# Altium project T1_Card.PrjPcb (part 2 of 6)

## Sheet LM76003.SchDoc
size 431 x 279 mm; Date: Not shown in title block; ApprovedBy: Not shown in title block; CheckedBy: Not shown in title block; Author: Not shown in title block; CompanyName: Not shown in title block; DrawnBy: Andy Lin (TI); Engineer: Not shown in title block; Organization: Not shown in title block; Address1: Not shown in title block; Address2: Not shown in title block; Address3: Not shown in title block; Address4: Not shown in title block; DocumentNumber: 6; Revision: Use project parameter SCH_Rev; SheetNumber: 6; SheetTotal: 14; PageSetup: Record=PageOptions|CenterHorizontal=True|CenterVertical=True|PrintScale=1.00|XCorrection=1.00|YCorrection=1.00|PrintKind=0|BorderSize=5000000|LeftOffset=0|BottomOffset=0|Orientation=2|PaperLength=1000|PaperWidth=1000|Scale=100|PaperSource=15|PrintQuality=600|MediaType=1|DitherType=10|PaperKind=Letter|PrintScaleMode=1; CurrentTime: Not shown in title block; CurrentDate: Not shown in title block; Time: Not shown in title block; DocumentFullPathAndName: Not shown in title block; DocumentName: Not shown in title block; ModifiedDate: Not shown in title block; ImagePath: Not shown in title block
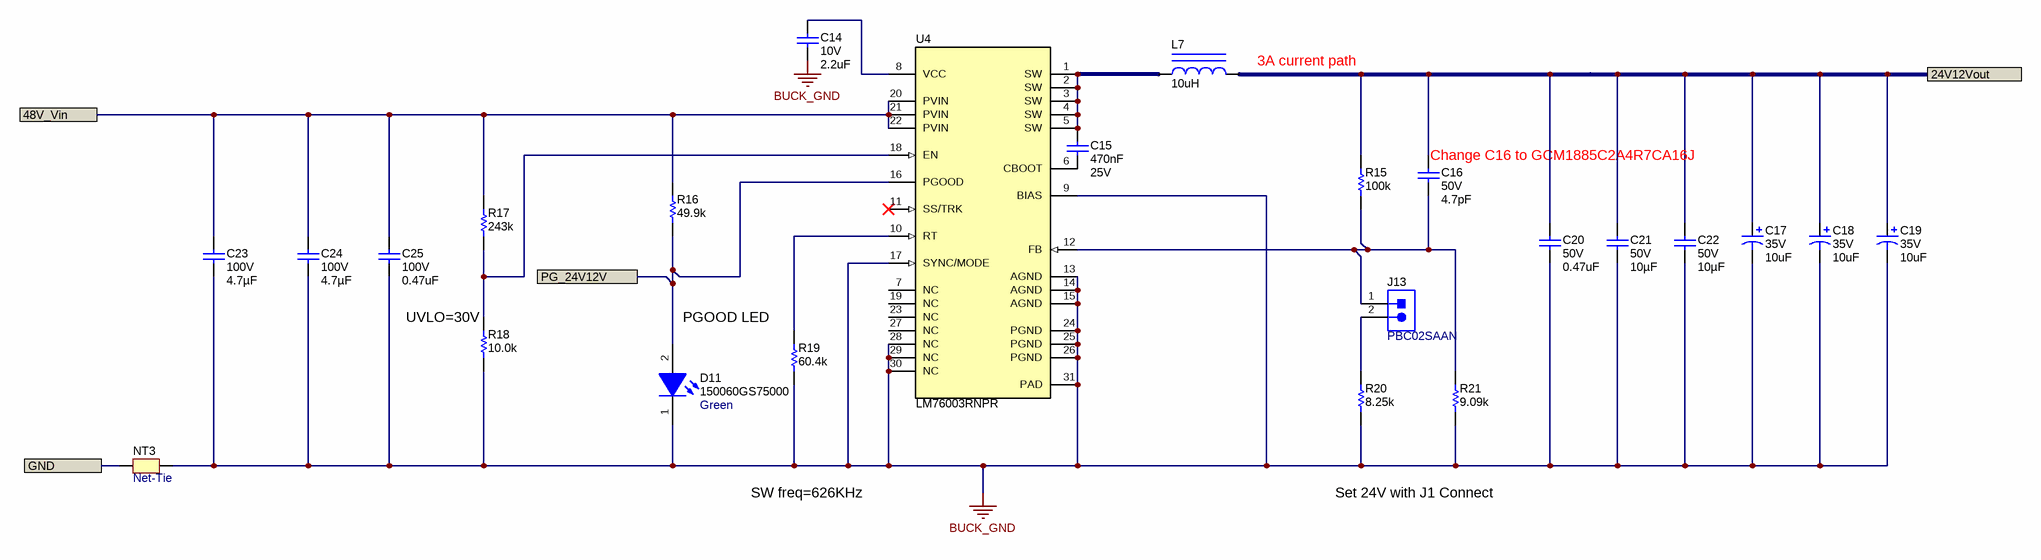
[diagram p3: LM76003.SchDoc]

### Parts
C14  VDC_V: 10V  ValueDisplayed: 2.2uF  [0603]  (hidden comment: GRM188R71A225KE15D)
C15  Cap_F: 470nF  VDC_V: 25V  [0603]  (hidden comment: GCM188R71E474KA64D)
C16  VDC_V: 50V  ValueDisplayed: 4.7pF  [0603]  (hidden comment: 06035A4R7CAT2A)
C17  VDC_V: 35V  ValueDisplayed: 10uF  [7343-31]  (hidden comment: 593D106X9035D2TE3)
C18  VDC_V: 35V  ValueDisplayed: 10uF  [7343-31]  (hidden comment: 593D106X9035D2TE3)
C19  VDC_V: 35V  ValueDisplayed: 10uF  [7343-31]  (hidden comment: 593D106X9035D2TE3)
C20  VDC_V: 50V  ValueDisplayed: 0.47uF  [0805_HV]  (hidden comment: GRM21BR71H474KA88L)
C21  VDC_V: 50V  ValueDisplayed: 10µF  [1210_280]  (hidden comment: GRJ32ER71H106KE11L)
C22  VDC_V: 50V  ValueDisplayed: 10µF  [1210_280]  (hidden comment: GRJ32ER71H106KE11L)
C23  VDC_V: 100V  ValueDisplayed: 4.7µF  [1210_220]  (hidden comment: GCM32DC72A475KE02L)
C24  VDC_V: 100V  ValueDisplayed: 4.7µF  [1210_220]  (hidden comment: GCM32DC72A475KE02L)
C25  VDC_V: 100V  ValueDisplayed: 0.47uF  [0805_HV]  (hidden comment: GRM21BR72A474KA73L)
D11  150060GS75000  value Green  [WL-SMCW_GREEN]
J13  PBC02SAAN  [Sullins_PBC02SAAN]
L7  ValueDisplayed: 10uH  [WE-LHMI_7030]  (hidden comment: 74437346100)
NT3  Net-Tie  [Net-Tie_50milWide_30milLong]  (net tie, no BOM)
R15  ValueDisplayed: 100k  [0402]  (hidden comment: CRCW0402100KFKED)
R16  ValueDisplayed: 49.9k  [0603]  (hidden comment: CRCW060349K9FKEA)
R17  ValueDisplayed: 243k  [0402]  (hidden comment: CRCW0402243KFKED)
R18  ValueDisplayed: 10.0k  [0402]  (hidden comment: CRCW040210K0FKED)
R19  ValueDisplayed: 60.4k  [0402]  (hidden comment: CRCW040260K4FKED)
R20  ValueDisplayed: 8.25k  [0402]  (hidden comment: CRCW04028K25FKED)
R21  ValueDisplayed: 9.09k  [0402]  (hidden comment: CRCW04029K09FKED)
U4  LM76003RNPR  [RNP0030B]

### Ports
24V12Vout, 48V_Vin, GND, PG_24V12V

### Nets
BUCK_GND: C14.2 C17.2(-) C18.2(-) C19.2(-) C20.2 C21.2 C22.2 C23.2 C24.2 C25.2 D11.1(K) NT3.2 R18.1 R19.1 R20.1 R21.1 U4.9(BIAS) U4.13(AGND) U4.14(AGND) U4.15(AGND) U4.17(SYNC/MODE) U4.24(PGND) U4.25(PGND) U4.26(PGND) U4.28(NC) U4.29(NC) U4.30(NC) U4.31(PAD)
ILIM_GND: NT3.1 ; port GND
24V12Vout: C16.1 C17.1(+) C18.1(+) C19.1(+) C20.1 C21.1 C22.1 L7.2 R15.2 ; port 24V12Vout
48V_Vin: C23.1 C24.1 C25.1 R16.2 R17.2 U4.20(PVIN) U4.21(PVIN) U4.22(PVIN) ; port 48V_Vin
PG_24V12V: D11.2(A) R16.1 U4.16(PGOOD) ; port PG_24V12V
NetC14_1: C14.1 U4.8(VCC)
NetC15_1: C15.1 L7.1 U4.1(SW) U4.2(SW) U4.3(SW) U4.4(SW) U4.5(SW)
NetC15_2: C15.2 U4.6(CBOOT)
NetC16_2: C16.2 J13.1 R15.1 R21.2 U4.12(FB)
NetJ13_2: J13.2 R20.2
NetR17_1: R17.1 R18.2 U4.18(EN)
NetR19_2: R19.2 U4.10(RT)

Not connected (* = marked no-connect by the designer): U4 7(NC) 11(SS/TRK)* 19(NC) 23(NC) 27(NC)

### Notes on the sheet
- (near L7) 3A current path
- (near C16) Change C16 to GCM1885C2A4R7CA16J
- (near R18) UVLO=30V
- PGOOD LED
- SW freq=626KHz
- Set 24V with J1 Connect
- Drawn By:
- SVN Rev:
- Number:
- TID #:
- Orderable:
- Rev:
- Sheet Title:
- File:
- Project Title:
- Designed for:
- Assembly Variant:
- Mod. Date:
- Sheet:
- Size:
- of
- B
- http://www.ti.com
- Texas Instruments and/or its licensors do not warrant the accuracy or completeness of this specification or any information contained therein. Texas Instruments and/or its licensors do not warrant that this design will meet the specifications, will be suitable for your application or fit for any particular purpose, or will operate in an implementation. Texas Instruments and/or its licensors do not warrant that the design is production worthy. You should completely validate and test your design implementation to confirm the system functionality for your application.
- Engineer:
- Contact:
- © Texas Instruments

### Library data of the parts
C14 = CMP-0007370-4: CAP, CERM, 2.2 uF, 10 V, +/- 10%, X7R, 0603; Manufacturer: MuRata; TaMin_C: -55°C; ESR_ohm: 9m; Polarized: N; SizeAreaWB_mm2: 4.68; Value1: 0.009 ohm; U/M: EA; Value: 2.2uF; TaMax_C: 125°C; SizeZ_mm: 1; SizeX_mm: 1.6; SizeY_mm: 0.8; SizeArea_mm2: 1.28; Cap_F: 2.2µF; AEC Category: Q200; Supplier Part Number 2: 81-GRM188R71A225KE15; Publisher: Texas Instruments; Supplier 2: Mouser; Supplier Part Number 3: 1797012; TempCo: X7R; Supplier 3: Farnell; Published: 2008-06-19; RoHS: Y; MountType: SMT; Supplier 1: Digi-Key; PackageReference: 0603; Tolerance_%: 10%; Cap_Case: 0603; Value2: 10V; CompType: Capacitor; LatestRevisionDate: 2017-03-09; PartNumber: GRM188R71A225KE15D; AEC Qualified: ?; ComponentLink1Description: Datasheet link; Supplier Part Number 1: 490-4520-1-ND; Technology: Ceramic; ComponentLink1URL: http://search.murata.co.jp/Ceramy/PnsearchViewAction.do?HnOFG=ON&HnNFG=ON&SEL_CNT=50&sLang=en&sKey=GRM188R71A225KE15D&x=9&y=9&search=startwith
C15 = CMP-0007142-4: CAP, CERM, 0.47 uF, 25 V, +/- 10%, X7R, AEC-Q200 Grade 1, 0603; Manufacturer: MuRata; TaMin_C: -55°C; Polarized: N; SizeAreaWB_mm2: 4.68; Value1: Unknown; U/M: EA; Value: 0.47uF; TaMax_C: 125°C; SizeZ_mm: 1; SizeX_mm: 1.6; SizeY_mm: 0.8; SizeArea_mm2: 1.28; AEC Qualified: Y; AEC Category: Q200; Supplier Part Number 2: 81-GCM188R71E474KA4D; Publisher: Texas Instruments; Supplier 2: Mouser; TempCo: X7R; Published: 2008-06-19; RoHS: Y; MountType: SMT; Supplier 1: Digi-Key; PackageReference: 0603; Tolerance_%: 10%; Cap_Case: 0603; Value2: 25V; CompType: Capacitor; LatestRevisionDate: 2017-03-09; PartNumber: GCM188R71E474KA64D; ComponentLink1Description: Datasheet link; AEC Grade: 1; Supplier Part Number 1: 490-4776-1-ND; Technology: Ceramic; ValueDisplayed: 0.47uF; ComponentLink1URL: http://psearch.murata.com/capacitor/product/GCM188R71E474KA64%23.pdf
C16 = CMP-0006791-4: CAP, CERM, 4.7 pF, 50 V, +/- 5%, C0G/NP0, 0603; Manufacturer: AVX; TaMin_C: -55°C; ESR_ohm: 0.633; Polarized: N; SizeAreaWB_mm2: 4.68; Value1: 0.633 ohm; U/M: EA; Value: 4.7pF; TaMax_C: 125°C; SizeZ_mm: 1; SizeX_mm: 1.6; SizeY_mm: 0.8; SizeArea_mm2: 1.28; AEC Category: Q200; Supplier Part Number 2: 581-06035A4R7C; Publisher: Texas Instruments; Supplier 2: Mouser; Supplier Part Number 3: 1833866; TempCo: C0G/NP0; Supplier 3: Farnell; Published: 2008-06-19; RoHS: Y; MountType: SMT; Supplier 1: Digi-Key; PackageReference: 0603; Tolerance_%: 5%; Cap_Case: 0603; Value2: 50V; CompType: Capacitor; LatestRevisionDate: 2017-03-09; PartNumber: 06035A4R7CAT2A; AEC Qualified: N; Cap_F: 4.7pF; ComponentLink1Description: Datasheet link; AEC Grade: N/A; Supplier Part Number 1: 478-1159-1-ND; Technology: Ceramic; ComponentLink1URL: http://datasheets.avx.com/C0GNP0-Dielectric.pdf
C17 = CMP-0011718-2: CAP, TA, 10 uF, 35 V, +/- 10%, 0.3 ohm, SMD; Manufacturer: Vishay-Sprague; TaMin_C: -55°C; ESR_ohm: 0.3; Polarized: Y; SizeAreaWB_mm2: 58.59; Value1: 0.3 ohm; U/M: EA; Value: 10uF; TaMax_C: 125°C; SizeZ_mm: 3.1; SizeX_mm: 7.3; SizeY_mm: 4.3; Cap_Case: D; SizeArea_mm2: 31.39; CompType: Capacitor; Cap_F: 10µF; IRMS_A: 710mA; AEC Category: Q200; ComponentLink1URL: http://www.vishay.com/docs/40005/593d.pdf; Supplier Part Number 2: 65K2991; Publisher: Texas Instruments; Supplier 2: Newark; Supplier Part Number 3: 74-593D106X9035D2TE3; Supplier 3: Mouser; RoHS: Y; MountType: SMT; Supplier 1: Digi-Key; LatestRevisionNote: Updated supplier links; PackageReference: 7343-31; Tolerance_%: 10%; Value2: 35V; LatestRevisionDate: 2017-03-09; PartNumber: 593D106X9035D2TE3; AEC Qualified: ?; Series: 593D; ComponentLink1Description: Datasheet link; Supplier Part Number 1: 718-1099-1-ND; Technology: TA
C18 C19 = CMP-0011718-1: CAP, TA, 10 uF, 35 V, +/- 10%, 0.3 ohm, SMD; Manufacturer: Vishay-Sprague; TaMin_C: -55°C; ESR_ohm: 0.3; Polarized: Y; SizeAreaWB_mm2: 58.59; Value1: 0.3 ohm; U/M: EA; Value: 10uF; TaMax_C: 125°C; SizeZ_mm: 3.1; SizeX_mm: 7.3; SizeY_mm: 4.3; Cap_Case: D; SizeArea_mm2: 31.39; CompType: Capacitor; Cap_F: 10µF; IRMS_A: 710mA; AEC Category: Q200; ComponentLink1URL: http://www.vishay.com/docs/40005/593d.pdf; Supplier Part Number 2: 65K2991; Publisher: Texas Instruments; Supplier 2: Newark; Supplier Part Number 3: 74-593D106X9035D2TE3; Supplier 3: Mouser; RoHS: Y; MountType: SMT; Supplier 1: Digi-Key; LatestRevisionNote: Updated supplier links; PackageReference: 7343-31; Tolerance_%: 10%; Value2: 35V; LatestRevisionDate: 2017-03-09; PartNumber: 593D106X9035D2TE3; AEC Qualified: ?; Series: 593D; ComponentLink1Description: Datasheet link; Supplier Part Number 1: 718-1099-1-ND; Technology: TA
C20 = CMP-0008357-1: CAP, CERM, 0.47 uF, 50 V, +/- 10%, X7R, 0805; Manufacturer: MuRata; TaMin_C: -55°C; Polarized: N; SizeAreaWB_mm2: 6.75; Value1: Unknown; U/M: EA; Value: 0.47uF; TaMax_C: 125°C; SizeZ_mm: 1.45; SizeX_mm: 2; SizeY_mm: 1.25; Cap_Case: 0805; SizeArea_mm2: 2.5; Cap_F: 470nF; AEC Category: Q200; ComponentLink1URL: http://search.murata.co.jp/Ceramy/PnsearchViewAction.do?HnOFG=ON&HnNFG=ON&SEL_CNT=50&sLang=en&sKey=GRM21BR71H474KA88L&x=9&y=9&search=startwith; Supplier Part Number 2: 81-GRM21BR71H474KA88; Publisher: Texas Instruments; Supplier 2: Mouser; Supplier Part Number 3: 1403966; TempCo: X7R; Supplier 3: Farnell; Published: 2008-06-19; RoHS: Y; MountType: SMT; Supplier 1: Digi-Key; PackageReference: 0805; Tolerance_%: 10%; Value2: 50V; CompType: Capacitor; LatestRevisionDate: 2017-03-09; PartNumber: GRM21BR71H474KA88L; AEC Qualified: ?; ComponentLink1Description: Datasheet link; Supplier Part Number 1: 490-3328-1-ND; Technology: Ceramic
C21 C22 = CMP-0081135-1: CAP, CERM, 10 µF, 50 V,+/- 10%, X7R, 1210; Manufacturer: MuRata; TaMin_C: -55°C; ESR_ohm: 1m; Polarized: N; SizeAreaWB_mm2: 14.7; Value1: 0.001 ohm; U/M: EA; Value: 10uF; TaMax_C: 125°C; SizeZ_mm: 2.8; SizeX_mm: 3.2; SizeY_mm: 2.5; Cap_Case: 1210; SizeArea_mm2: 8; AEC Category: Q200; ComponentLink1URL: https://search.murata.co.jp/Ceramy/image/img/A01X/G101/ENG/GRJ32ER71H106KE11-01.pdf; Supplier Part Number 2: 81-GRJ32ER71H106KE1L; Supplier 2: Mouser; TempCo: X7R; RoHS: Y; MountType: SMT; Supplier 1: Digi-Key; PackageReference: 1210; Tolerance_%: 10%; Value2: 50V; CompType: Capacitor; PartNumber: GRJ32ER71H106KE11L; AEC Qualified: N; Cap_F: 10µF; ComponentLink1Description: Datasheet link; AEC Grade: N/A; Supplier Part Number 1: 490-10961-1-ND; Technology: Ceramic
C23 C24 = CMP-0082268-1: CAP, CERM, 4.7 µF, 100 V,+/- 10%, X7S, AEC-Q200 Grade 1, 1210; Manufacturer: MuRata; TaMin_C: -55°C; ESR_ohm: 1m; Polarized: N; SizeAreaWB_mm2: 14.7; Value1: 0.001 ohm; U/M: EA; Value: 4.7uF; TaMax_C: 125°C; SizeZ_mm: 2.2; SizeX_mm: 3.2; SizeY_mm: 2.5; Cap_Case: 1210; SizeArea_mm2: 8; AEC Qualified: Y; IRMS_A: 6A; AEC Grade: 1; AEC Category: Q200; ComponentLink1URL: https://search.murata.co.jp/Ceramy/image/img/A01X/G101/ENG/GCM32DC72A475KE02-01.pdf; Supplier Part Number 2: 81-GCM32DC72A475KE2L; Supplier 2: Mouser; TempCo: X7S; RoHS: Y; MountType: SMT; Supplier 1: Digi-Key; PackageReference: 1210; Tolerance_%: 10%; Value2: 100V; CompType: Capacitor; PartNumber: GCM32DC72A475KE02L; Cap_F: 4.7µF; ComponentLink1Description: Datasheet link; Supplier Part Number 1: 490-14484-1-ND; Technology: Ceramic
C25 = CMP-0008374-2: CAP, CERM, 0.47 uF, 100 V, +/- 10%, X7R, 0805; Manufacturer: MuRata; TaMin_C: -55°C; Polarized: N; SizeAreaWB_mm2: 6.75; Value1: Unknown; U/M: EA; Value: 0.47uF; TaMax_C: 125°C; SizeZ_mm: 1.45; SizeX_mm: 2; SizeY_mm: 1.25; Cap_Case: 0805; SizeArea_mm2: 2.5; Cap_F: 470nF; AEC Category: Q200; Supplier Part Number 2: 81-GRM21BR72A474KA73; Publisher: Texas Instruments; Supplier 2: Mouser; TempCo: X7R; Published: 2008-06-19; RoHS: Y; MountType: SMT; Supplier 1: Digi-Key; PackageReference: 0805; Tolerance_%: 10%; Value2: 100V; CompType: Capacitor; LatestRevisionDate: 2017-03-09; PartNumber: GRM21BR72A474KA73L; AEC Qualified: ?; ComponentLink1Description: Datasheet link; Supplier Part Number 1: 490-3326-1-ND; Technology: Ceramic; ComponentLink1URL: http://search.murata.co.jp/Ceramy/PnsearchViewAction.do?HnOFG=ON&HnNFG=ON&SEL_CNT=50&sLang=en&sKey=GRM21BR72A474KA73L&x=9&y=9&search=startwith
D11 = CMP-0002905-2: LED, Green, SMD; Manufacturer: Wurth Elektronik; Value1: W; Type: InGaN; Value2: 3.2V; Io_A: 20mA; Angle: 140; Tjmax_C: 85°C; Color: Green; Vf_V: 3.2V; PartNumber: 150060GS75000; ComponentLink1Description: Datasheet link; ComponentLink1URL: http://katalog.we-online.de/led/datasheet/150060GS75000.pdf; MountType: SMT; PackageReference: LED_0603; CompType: LED; RoHS: Y
J13 = CMP-0054566-1: Header, 100mil, 2x1, Gold, TH; Manufacturer: Sullins Connector Solutions; CNHeader: TRUE; Current_A: 3A; Green_Lifecycle: Active; Shrouded: N; Gender: Male; Green_REACh: Passed; Voltage_V: 1.8kV; Row_Count: 1; Pitch_mm: 2.54; CT: FALSE; Cert_UL: Y; ComponentLink1URL: http://www.sullinscorp.com/catalogs/77_PAGE108-109_.100_MALE_HDR.pdf; ClassName: Header; Publisher: Texas Instruments; Color: Black; RoHS: Y; MountType: TH; Green_EU RoHS-2: Passed; Supplier 1: Digi-Key; Green_EU RoHS: Passed; PackageReference: Sullins 100mil, 1x2, 230 mil above insulator; PinCount: 2; CompType: Header; LatestRevisionDate: 26/05/2017; PartNumber: PBC02SAAN; Orientation: Vertical; ComponentLink1Description: Datasheet URL; Supplier Part Number 1: S1011E-02-ND; ContactFinish: Gold
L7 = CMP-0064098-1: Inductor, Shielded Drum Core, Powdered Iron, 10 uH, 3 A, 0.075 ohm, SMD; Manufacturer: Wurth Elektronik; Isat: 7.3A @ 20% inductance drop; Irms: 3A @ 40C rise; Green_Lifecycle: Active; SizeAreaWB_mm2: 73.96; DCR_ohm: 0.075; Green_REACh: Passed; Value: 10uH; Imax_A: 3A; SizeZ_mm: 3; SizeX_mm: 6.6; SizeArea_mm2: 43.56; Ind_H: 10µH; AEC Qualified: N; AEC Category: Q200; ComponentLink1URL: http://katalog.we-online.de/kataloge/eisos/media/pdf/74437346100.pdf; Publisher: Texas Instruments; Published: 2008-06-26; RoHS: Y; Value1: 0.075 ohm; Material: Powdered Iron; MountType: SMT; Green_EU RoHS-2: Incomplete; Supplier 1: Digi-Key; Green_EU RoHS: Passed; PackageReference: 7.30x2.80x6.60mm; SizeY_mm: 6.6; Value2: 3A; CompType: Inductor; LatestRevisionDate: 2017-06-02; PartNumber: 74437346100; ComponentLink1Description: Datasheet link; AEC Grade: N/A; Supplier Part Number 1: 732-3379-1-ND; Technology: Shielded Drum Core
NT3 = CMP-0078142-2: Single point connection between nets.; CompType: Net-Tie; PackageReference: N/A; Library Reference: Net-Tie; Manufacturer: N/A; PartNumber: N/A; MountType: SMT
R15 = CMP-0025950-3: RES, 100 k, 1%, 0.063 W, AEC-Q200 Grade 0, 0402; Manufacturer: Vishay-Dale; Power_W: 63mW; TempCo: 100 ppm/C; Value: 100k; EIA_Code: E96; SizeX_mm: 1; SizeY_mm: 0.5; SizeZ_mm: 0.6; Value2: 0.063W; AEC Qualified: Y; VDC_V: 50V; AEC Category: Q200; AEC Grade: 0; Supplier Part Number 2: 52K6607; Supplier 2: Newark; Supplier Part Number 3: 71-CRCW0402-100K-E3; Supplier 3: Mouser; Value_Code: 100k; RoHS: E; Value1: 1%; MountType: SMT; Supplier 1: Digi-Key; PackageReference: 0402; Tolerance_%: 1%; Res_ohm: 100k; SizeArea_mm2: 0.5; CompType: Resistor; PartNumber: CRCW0402100KFKED; ComponentLink1Description: Datasheet link; Supplier Part Number 1: 541-100KLCT-ND; Technology: Thick Film; ComponentLink1URL: http://www.vishay.com/docs/20035/dcrcwe3.pdf
R16 = CMP-0022447-1: as R107 on sheet T1_Power_Top_Level; ComponentLink1URL: http://www.vishay.com/docs/20035/dcrcwe3.pdf; Supplier Part Number 2: 71-CRCW0603-49.9K-E3; Publisher: Texas Instruments; Supplier 2: Mouser; Supplier Part Number 3: 1652882; Supplier 3: Farnell; Published: 2008-06-26; RoHS: Y; Value1: 1%; MountType: SMT; Supplier 1: Digi-Key; PackageReference: 0603; Tolerance_%: 1%; Res_ohm: 49.9k; CompType: Resistor; LatestRevisionDate: 2017-03-09; PartNumber: CRCW060349K9FKEA; AEC Qualified: ?; ComponentLink1Description: Datasheet link; Supplier Part Number 1: 541-49.9KHCT-ND; Technology: Thick Film
R17 = CMP-0026191-2: RES, 243 k, 1%, 0.063 W, AEC-Q200 Grade 0, 0402; Manufacturer: Vishay-Dale; Power_W: 63mW; TempCo: 100 ppm/C; Value: 243k; EIA_Code: E96; SizeX_mm: 1; SizeY_mm: 0.5; SizeZ_mm: 0.6; Value2: 0.063W; AEC Qualified: Y; VDC_V: 50V; AEC Category: Q200; AEC Grade: 0; ComponentLink1URL: http://www.vishay.com/docs/20035/dcrcwe3.pdf; Supplier Part Number 2: 52K6881; Supplier 2: Newark; Supplier Part Number 3: 71-CRCW0402-243K-E3; Supplier 3: Mouser; Value_Code: 243k; RoHS: E; Value1: 1%; MountType: SMT; Supplier 1: Digi-Key; PackageReference: 0402; Tolerance_%: 1%; Res_ohm: 243k; SizeArea_mm2: 0.5; CompType: Resistor; PartNumber: CRCW0402243KFKED; ComponentLink1Description: Datasheet link; Supplier Part Number 1: 541-243KLCT-ND; Technology: Thick Film
R18 = CMP-0025958-3: RES, 10.0 k, 1%, 0.063 W, AEC-Q200 Grade 0, 0402; Manufacturer: Vishay-Dale; Power_W: 63mW; TempCo: 100 ppm/C; Value_Code: 10k0; Value: 10.0k; EIA_Code: E96; Res_ohm: 10k; SizeX_mm: 1; SizeY_mm: 0.5; SizeZ_mm: 0.6; Value2: 0.063W; AEC Qualified: Y; VDC_V: 50V; AEC Category: Q200; AEC Grade: 0; Supplier Part Number 2: 52K6595; Supplier 2: Newark; Supplier Part Number 3: 71-CRCW0402-10K-E3; Supplier 3: Mouser; RoHS: E; Value1: 1%; MountType: SMT; Supplier 1: Digi-Key; PackageReference: 0402; Tolerance_%: 1%; SizeArea_mm2: 0.5; CompType: Resistor; PartNumber: CRCW040210K0FKED; ComponentLink1Description: Datasheet link; Supplier Part Number 1: 541-10.0KLCT-ND; Technology: Thick Film; ComponentLink1URL: http://www.vishay.com/docs/20035/dcrcwe3.pdf
R19 = CMP-0026486-2: RES, 60.4 k, 1%, 0.063 W, AEC-Q200 Grade 0, 0402; Manufacturer: Vishay-Dale; Power_W: 63mW; TempCo: 100 ppm/C; Value_Code: 60k4; Value: 60.4k; EIA_Code: E96; SizeX_mm: 1; SizeY_mm: 0.5; SizeZ_mm: 0.6; Value2: 0.063W; AEC Qualified: Y; VDC_V: 50V; AEC Category: Q200; AEC Grade: 0; ComponentLink1URL: http://www.vishay.com/docs/20035/dcrcwe3.pdf; Supplier Part Number 2: 52K7190; Supplier 2: Newark; Supplier Part Number 3: 71-CRCW0402-60.4K-E3; Supplier 3: Mouser; RoHS: E; Value1: 1%; MountType: SMT; Supplier 1: Digi-Key; PackageReference: 0402; Tolerance_%: 1%; Res_ohm: 60.4k; SizeArea_mm2: 0.5; CompType: Resistor; PartNumber: CRCW040260K4FKED; ComponentLink1Description: Datasheet link; Supplier Part Number 1: 541-60.4KLCT-ND; Technology: Thick Film
R20 = CMP-0026589-2: RES, 8.25 k, 1%, 0.063 W, AEC-Q200 Grade 0, 0402; Manufacturer: Vishay-Dale; Power_W: 63mW; TempCo: 100 ppm/C; Value_Code: 8k25; Value: 8.25k; EIA_Code: E96; SizeX_mm: 1; SizeY_mm: 0.5; SizeZ_mm: 0.6; Value2: 0.063W; AEC Qualified: Y; VDC_V: 50V; AEC Category: Q200; AEC Grade: 0; ComponentLink1URL: http://www.vishay.com/docs/20035/dcrcwe3.pdf; Supplier Part Number 2: 52K7288; Supplier 2: Newark; Supplier Part Number 3: 71-CRCW0402-8.25K-E3; Supplier 3: Mouser; RoHS: E; Value1: 1%; MountType: SMT; Supplier 1: Digi-Key; PackageReference: 0402; Tolerance_%: 1%; Res_ohm: 8.25k; SizeArea_mm2: 0.5; CompType: Resistor; PartNumber: CRCW04028K25FKED; ComponentLink1Description: Datasheet link; Supplier Part Number 1: 541-8.25KLCT-ND; Technology: Thick Film
R21 = CMP-0026619-3: RES, 9.09 k, 1%, 0.063 W, AEC-Q200 Grade 0, 0402; Manufacturer: Vishay-Dale; VDC_V: 50V; Value2: 0.063W; Power_W: 63mW; AEC Qualified: Y; SizeZ_mm: 0.6; TempCo: 100 ppm/C; SizeArea_mm2: 0.5; SizeX_mm: 1; Value: 9.09k; Value_Code: 9k09; AEC Category: Q200; AEC Grade: 0; EIA_Code: E96; PartNumber: CRCW04029K09FKED; Supplier Part Number 3: 71-CRCW0402-9.09K-E3; Supplier 1: Digi-Key; CompType: Resistor; Supplier Part Number 1: 541-9.09KLCT-ND; Supplier 2: Newark; SizeY_mm: 0.5; Value1: 1%; ComponentLink1Description: Datasheet link; Res_ohm: 9.09k; ComponentLink1URL: http://www.vishay.com/docs/20035/dcrcwe3.pdf; Technology: Thick Film; MountType: SMT; Supplier Part Number 2: 52K7332; PackageReference: 0402; Supplier 3: Mouser; Tolerance_%: 1%; RoHS: E
U4 = CMP-0013938-2: SIMPLE SWITCHER 3.5V to 60V 3.5A Synchronous Step-Down Voltage Regulator, RNP0030B (WQFN-30); Manufacturer: Texas Instruments; Alternate PartNumber: LM76003RNPT; SizeX_mm: 4; SizeY_mm: 6; CompType: IC; SizeZ_mm: 0.8; SizeArea_mm2: 24; SizeAreaWB_mm2: 48; U/M: EA; PackageDescription: WQFN-30; PartNumber: LM76003RNPR; ComponentLink1URL: https://sps06.itg.ti.com/sites/KMS/crossdivteams/altium/docs/ComponentDatasheets/LM76003_prelimDS_Jan 26 2017.docx; ComponentLink1Description: Datasheet Link; LatestRevisionDate: 2017-03-09; Publisher: Texas Instruments; PackageReference: RNP0030B; MountType: SMT; Alternate Manufacturer: Texas Instruments

## Sheet LMZM33603.SchDoc
size 431 x 279 mm; Date: Not shown in title block; ApprovedBy: Not shown in title block; CheckedBy: Not shown in title block; Author: Not shown in title block; CompanyName: Not shown in title block; DrawnBy: Andy Lin (TI); Engineer: Not shown in title block; Organization: Not shown in title block; Address1: Not shown in title block; Address2: Not shown in title block; Address3: Not shown in title block; Address4: Not shown in title block; DocumentNumber: 7; Revision: Use project parameter SCH_Rev; SheetNumber: 7; SheetTotal: 14; PageSetup: Record=PageOptions|CenterHorizontal=True|CenterVertical=True|PrintScale=1.00|XCorrection=1.00|YCorrection=1.00|PrintKind=0|BorderSize=5000000|LeftOffset=0|BottomOffset=0|Orientation=2|PaperLength=1000|PaperWidth=1000|Scale=100|PaperSource=15|PrintQuality=600|MediaType=1|DitherType=10|PaperKind=Letter|PrintScaleMode=1; CurrentTime: Not shown in title block; CurrentDate: Not shown in title block; Time: Not shown in title block; DocumentFullPathAndName: Not shown in title block; DocumentName: Not shown in title block; ModifiedDate: Not shown in title block; ImagePath: Not shown in title block
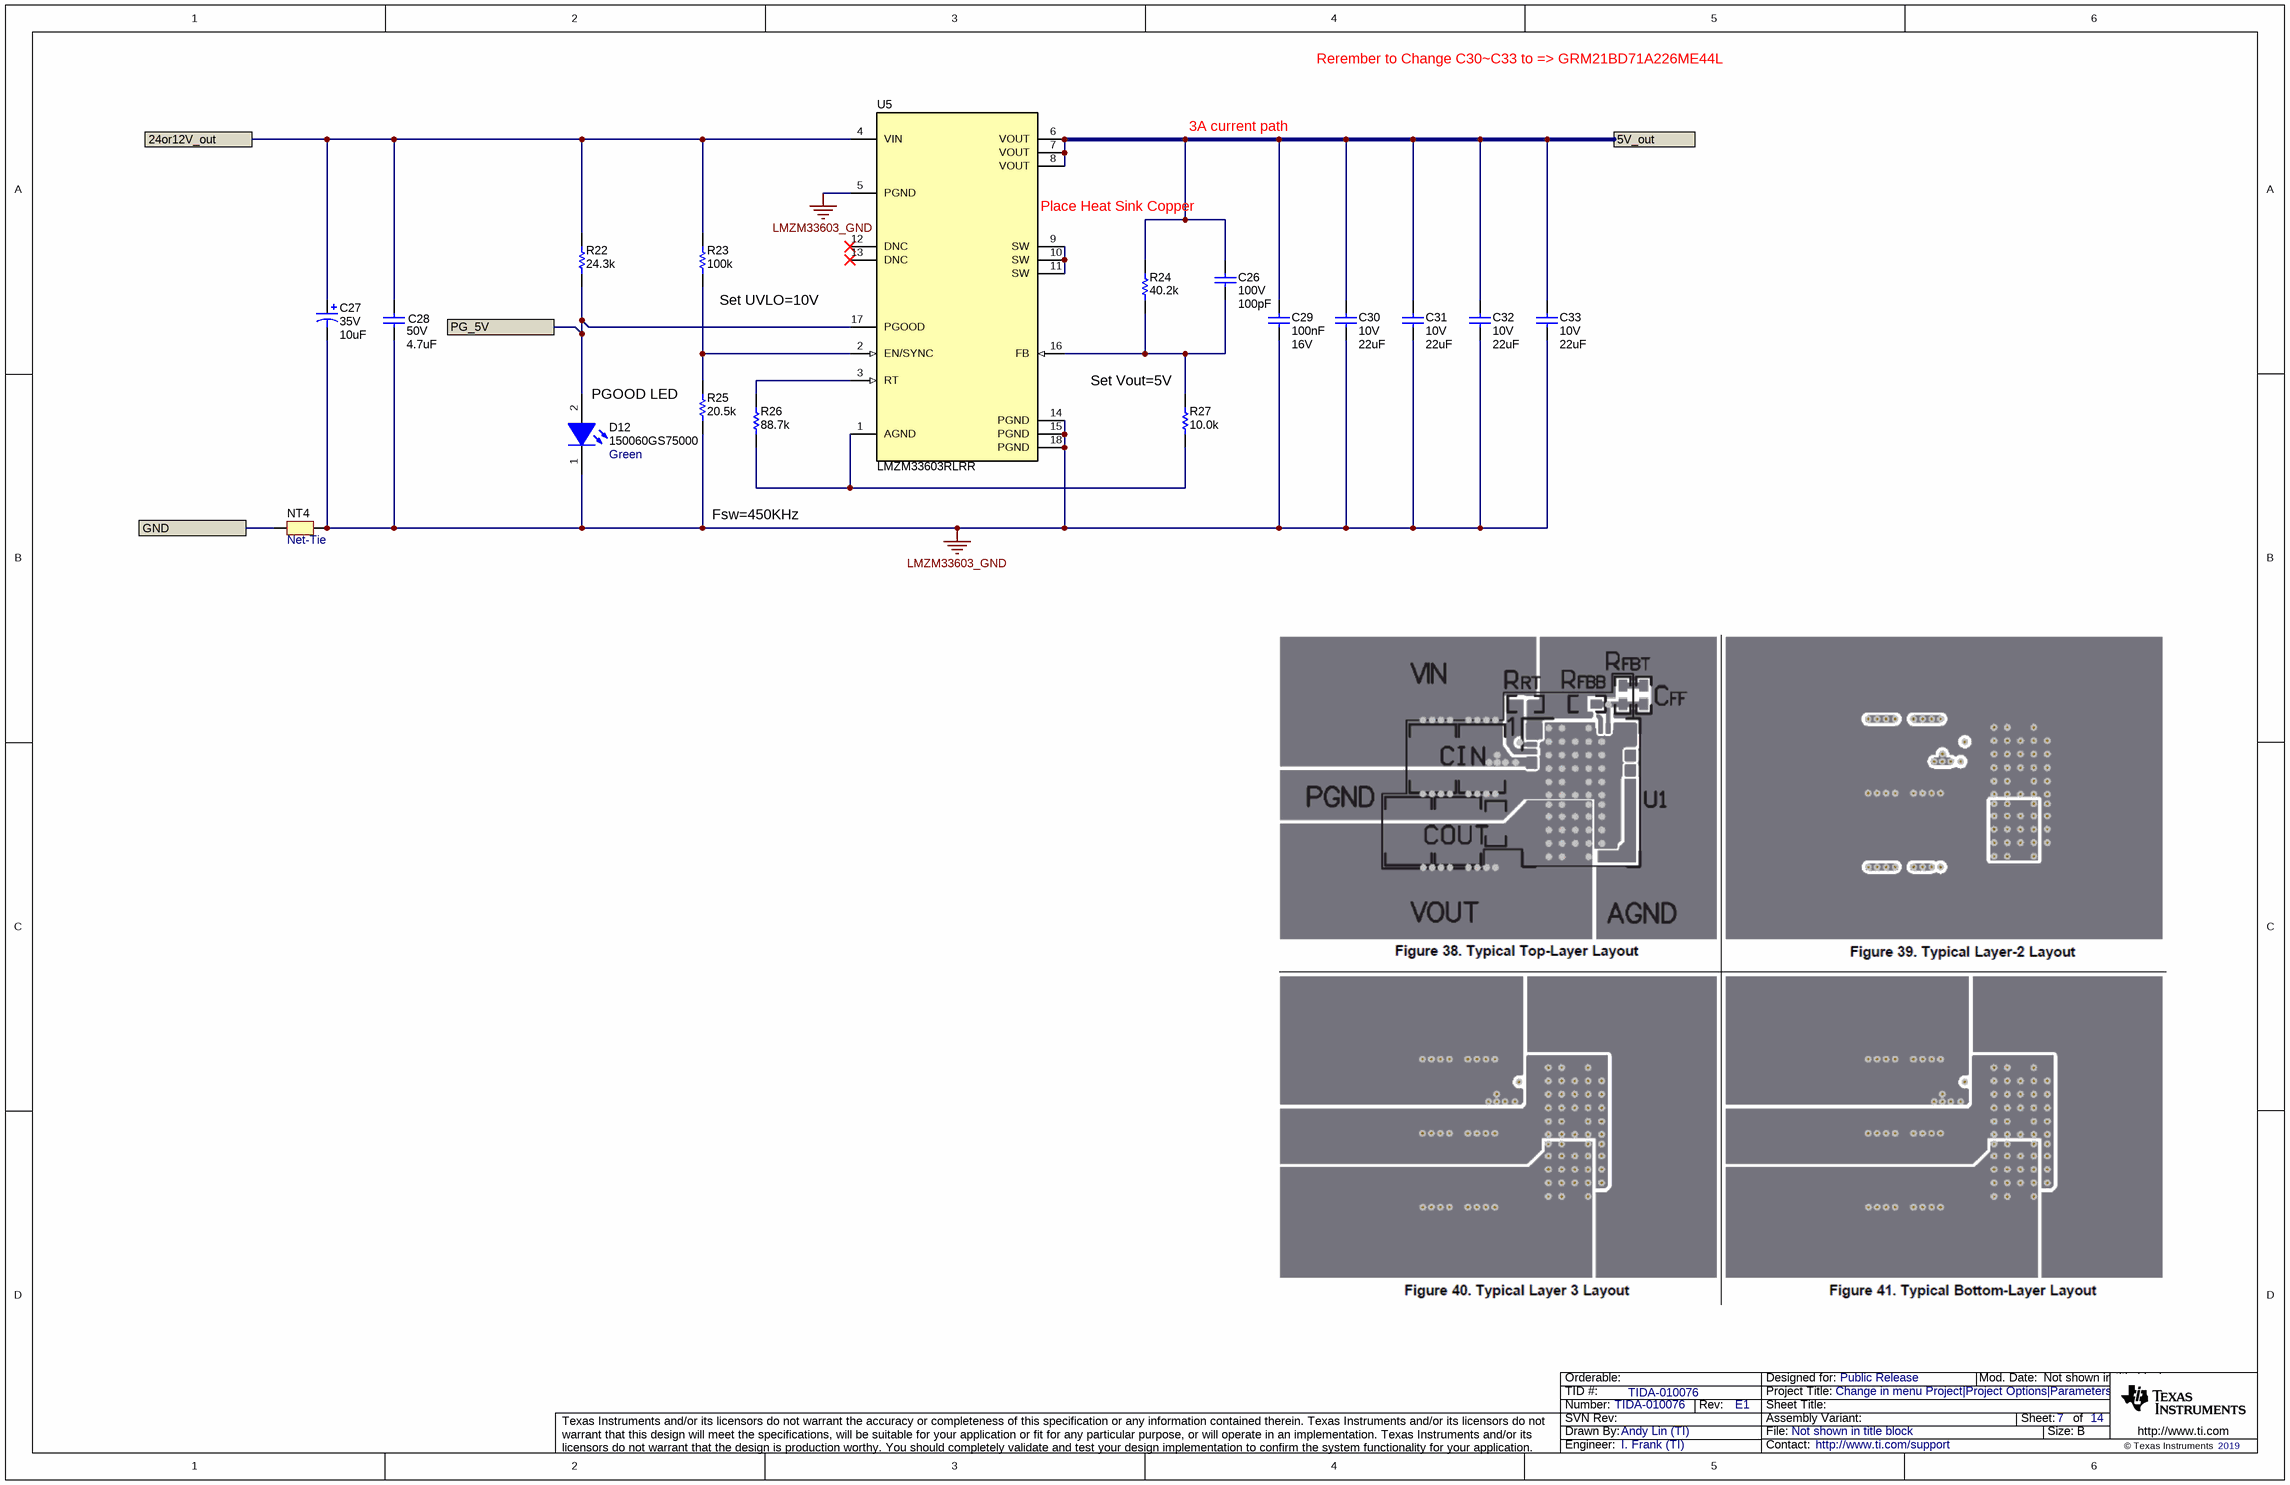
[diagram p4: LMZM33603.SchDoc]

### Parts
C26  VDC_V: 100V  ValueDisplayed: 100pF  [0603]  (hidden comment: GRM1885C2A101JA01D)
C27  VDC_V: 35V  ValueDisplayed: 10uF  [7343-31]  (hidden comment: 593D106X9035D2TE3)
C28  VDC_V: 50V  ValueDisplayed: 4.7uF  [1210_270]  (hidden comment: GRM32ER71H475KA88L)
C29  Cap_F: 100nF  VDC_V: 16V  [0603]  (hidden comment: GRM188R71C104KA01D)
C30  VDC_V: 10V  ValueDisplayed: 22uF  [0805_HV]  (hidden comment: GRM21BZ71A226ME15L)
C31  VDC_V: 10V  ValueDisplayed: 22uF  [0805_HV]  (hidden comment: GRM21BZ71A226ME15L)
C32  VDC_V: 10V  ValueDisplayed: 22uF  [0805_HV]  (hidden comment: GRM21BZ71A226ME15L)
C33  VDC_V: 10V  ValueDisplayed: 22uF  [0805_HV]  (hidden comment: GRM21BZ71A226ME15L)
D12  150060GS75000  value Green  [WL-SMCW_GREEN]
NT4  Net-Tie  [Net-Tie_50milWide_30milLong]  (net tie, no BOM)
R22  ValueDisplayed: 24.3k  [0603]  (hidden comment: CRCW060324K3FKEA)
R23  ValueDisplayed: 100k  [0402]  (hidden comment: CRCW0402100KFKED)
R24  ValueDisplayed: 40.2k  [0402]  (hidden comment: CRCW040240K2FKED)
R25  ValueDisplayed: 20.5k  [0402]  (hidden comment: CRCW040220K5FKED)
R26  ValueDisplayed: 88.7k  [0402]  (hidden comment: CRCW040288K7FKED)
R27  ValueDisplayed: 10.0k  [0402]  (hidden comment: CRCW040210K0FKED)
U5  LMZM33603RLRR  [RLR0018A]

### Ports
5V_out, 24or12V_out, GND, PG_5V

### Nets
ILIM_GND: NT4.1 ; port GND
LMZM33603_GND: C27.2(-) C28.2 C29.2 C30.2 C31.2 C32.2 C33.2 D12.1(K) NT4.2 R25.1 U5.5(PGND) U5.14(PGND) U5.15(PGND) U5.18(PGND)
5V_out: C26.1 C29.1 C30.1 C31.1 C32.1 C33.1 R24.2 U5.6(VOUT) U5.7(VOUT) U5.8(VOUT) ; port 5V_out
24or12V_out: C27.1(+) C28.1 R22.2 R23.2 U5.4(VIN) ; port 24or12V_out
PG_5V: D12.2(A) R22.1 U5.17(PGOOD) ; port PG_5V
NetC26_2: C26.2 R24.1 R27.2 U5.16(FB)
NetR23_1: R23.1 R25.2 U5.2(EN/SYNC)
NetR26_1: R26.1 R27.1 U5.1(AGND)
NetR26_2: R26.2 U5.3(RT)
NetU5_9: U5.9(SW) U5.10(SW) U5.11(SW)

Not connected (* = marked no-connect by the designer): U5 12(DNC)* 13(DNC)*

### Notes on the sheet
- Rerember to Change C30~C33 to => GRM21BD71A226ME44L
- 3A current path
- (near U5) Place Heat Sink Copper
- (near R23) Set UVLO=10V
- PGOOD LED
- (near R27) Set Vout=5V
- Fsw=450KHz
- Drawn By:
- SVN Rev:
- Number:
- TID #:
- Orderable:
- Rev:
- Sheet Title:
- File:
- Project Title:
- Designed for:
- Assembly Variant:
- Mod. Date:
- Sheet:
- Size:
- of
- B
- http://www.ti.com
- Texas Instruments and/or its licensors do not warrant the accuracy or completeness of this specification or any information contained therein. Texas Instruments and/or its licensors do not warrant that this design will meet the specifications, will be suitable for your application or fit for any particular purpose, or will operate in an implementation. Texas Instruments and/or its licensors do not warrant that the design is production worthy. You should completely validate and test your design implementation to confirm the system functionality for your application.
- Engineer:
- Contact:
- © Texas Instruments

### Library data of the parts
C26 = CMP-0007237-1: CAP, CERM, 100 pF, 100 V, +/- 5%, C0G/NP0, 0603; Manufacturer: MuRata; TaMin_C: -55°C; Polarized: N; SizeAreaWB_mm2: 4.68; Value1: Unknown; U/M: EA; Value: 100pF; TaMax_C: 125°C; SizeZ_mm: 1; SizeX_mm: 1.6; SizeY_mm: 0.8; SizeArea_mm2: 1.28; AEC Category: Q200; ComponentLink1URL: http://search.murata.co.jp/Ceramy/PnsearchViewAction.do?HnOFG=ON&HnNFG=ON&SEL_CNT=50&sLang=en&sKey=GRM1885C2A101JA01D&x=9&y=9&search=startwith; Supplier Part Number 2: 81-GRM1885C2A101JA01; Publisher: Texas Instruments; Supplier 2: Mouser; Supplier Part Number 3: 1828919; TempCo: C0G/NP0; Supplier 3: Farnell; Published: 2008-06-19; RoHS: Y; MountType: SMT; Supplier 1: Digi-Key; PackageReference: 0603; Tolerance_%: 5%; Cap_Case: 0603; Value2: 100V; CompType: Capacitor; LatestRevisionDate: 2017-03-09; PartNumber: GRM1885C2A101JA01D; AEC Qualified: ?; Cap_F: 100pF; ComponentLink1Description: Datasheet link; Supplier Part Number 1: 490-1351-1-ND; Technology: Ceramic
C27 = CMP-0011718-1: as C18 on sheet LM76003; ComponentLink1URL: http://www.vishay.com/docs/40005/593d.pdf; Supplier Part Number 2: 65K2991; Publisher: Texas Instruments; Supplier 2: Newark; Supplier Part Number 3: 74-593D106X9035D2TE3; Supplier 3: Mouser; RoHS: Y; MountType: SMT; Supplier 1: Digi-Key; LatestRevisionNote: Updated supplier links; PackageReference: 7343-31; Tolerance_%: 10%; Value2: 35V; LatestRevisionDate: 2017-03-09; PartNumber: 593D106X9035D2TE3; AEC Qualified: ?; Series: 593D; ComponentLink1Description: Datasheet link; Supplier Part Number 1: 718-1099-1-ND; Technology: TA
C28 = CMP-0009228-1: CAP, CERM, 4.7 uF, 50 V, +/- 10%, X7R, 1210; Manufacturer: MuRata; TaMin_C: -55°C; ESR_ohm: 2m; Polarized: N; SizeAreaWB_mm2: 14.7; Value1: 0.002 ohm; U/M: EA; Value: 4.7uF; TaMax_C: 125°C; SizeZ_mm: 2.7; SizeX_mm: 3.2; SizeY_mm: 2.5; Cap_Case: 1210; SizeArea_mm2: 8; Cap_F: 4.7µF; AEC Category: Q200; ComponentLink1URL: http://search.murata.co.jp/Ceramy/PnsearchViewAction.do?HnOFG=ON&HnNFG=ON&SEL_CNT=50&sLang=en&sKey=GRM32ER71H475KA88L&x=9&y=9&search=startwith; Supplier Part Number 2: 81-GRM32R71H475KA88L; Publisher: Texas Instruments; Supplier 2: Mouser; Supplier Part Number 3: 1828841; TempCo: X7R; Supplier 3: Farnell; Published: 2008-06-19; RoHS: Y; MountType: SMT; Supplier 1: Digi-Key; PackageReference: 1210; Tolerance_%: 10%; Value2: 50V; CompType: Capacitor; LatestRevisionDate: 2017-03-09; PartNumber: GRM32ER71H475KA88L; AEC Qualified: ?; ComponentLink1Description: Datasheet link; Supplier Part Number 1: 490-1864-1-ND; Technology: Ceramic
C29 = CMP-0007378-4: as C4 on sheet T1_Power_Top_Level; Supplier Part Number 2: 81-GRM39X104K16; Publisher: Texas Instruments; Supplier 2: Mouser; Supplier Part Number 3: 1828890; TempCo: X7R; Supplier 3: Farnell; Published: 2008-06-19; RoHS: Y; MountType: SMT; Supplier 1: Digi-Key; PackageReference: 0603; Tolerance_%: 10%; Cap_Case: 0603; Value2: 16V; CompType: Capacitor; LatestRevisionDate: 2017-03-09; PartNumber: GRM188R71C104KA01D; AEC Qualified: ?; ComponentLink1Description: Datasheet link; Supplier Part Number 1: 490-1532-1-ND; Technology: Ceramic; ValueDisplayed: 0.1uF; ComponentLink1URL: http://search.murata.co.jp/Ceramy/PnsearchViewAction.do?HnOFG=ON&HnNFG=ON&SEL_CNT=50&sLang=en&sKey=GRM188R71C104KA01D&x=9&y=9&search=startwith
C30-C33 = CMP-0008377-2: CAP, CERM, 22 uF, 10 V, +/- 20%, X7R, 0805; Manufacturer: MuRata; SizeY_mm: 1.25; Cap_Case: 0805; SizeArea_mm2: 2.5; AEC Qualified: N; Cap_F: 22µF; AEC Category: Q200; TaMin_C: -55°C; SizeAreaWB_mm2: 6.75; Value1: Unknown; U/M: EA; Value: 22uF; TaMax_C: 125°C; SizeZ_mm: 1.45; SizeX_mm: 2; Value2: 10V; CompType: Capacitor; LatestRevisionDate: 2017-03-09; PartNumber: GRM21BZ71A226ME15L; ComponentLink1Description: Datasheet link; AEC Grade: N/A; Supplier Part Number 1: 81-GRM21BZ71A226ME5L; Technology: Ceramic; ComponentLink1URL: http://psearch.en.murata.com/capacitor/product/GRM21BZ71A226ME15%23.pdf; Publisher: Texas Instruments; Polarized: N; TempCo: X7R; Published: 2008-06-19; RoHS: Y; MountType: SMT; Supplier 1: Mouser; PackageReference: 0805; Tolerance_%: 20%
D12 = CMP-0002905-2: as D11 on sheet LM76003; Color: Green; Vf_V: 3.2V; PartNumber: 150060GS75000; ComponentLink1Description: Datasheet link; ComponentLink1URL: http://katalog.we-online.de/led/datasheet/150060GS75000.pdf; MountType: SMT; PackageReference: LED_0603; CompType: LED; RoHS: Y
NT4 = CMP-0078142-2: Single point connection between nets.; CompType: Net-Tie; PackageReference: N/A; Library Reference: Net-Tie; Manufacturer: N/A; PartNumber: N/A; MountType: SMT
R22 = CMP-0022236-1: RES, 24.3 k, 1%, 0.1 W, 0603; Manufacturer: Vishay-Dale; Power_W: 100mW; TempCo: 100 ppm/C; Value_Code: 24k3; U/M: EA; Value: 24.3k; EIA_Code: E96; SizeX_mm: 1.6; SizeY_mm: 0.8; SizeZ_mm: 1; Value2: 0.1W; SizeArea_mm2: 1.28; VDC_V: 75V; AEC Category: Q200; ComponentLink1URL: http://www.vishay.com/docs/20035/dcrcwe3.pdf; Supplier Part Number 2: 52K8314; Publisher: Texas Instruments; Supplier 2: Newark; Supplier Part Number 3: 71-CRCW0603-24.3K-E3; Supplier 3: Mouser; Published: 2008-06-26; RoHS: Y; Value1: 1%; MountType: SMT; Supplier 1: Digi-Key; PackageReference: 0603; Tolerance_%: 1%; Res_ohm: 24.3k; CompType: Resistor; LatestRevisionDate: 2017-03-09; PartNumber: CRCW060324K3FKEA; AEC Qualified: ?; ComponentLink1Description: Datasheet link; Supplier Part Number 1: 541-24.3KHCT-ND; Technology: Thick Film
R23 = CMP-0025950-3: as R15 on sheet LM76003; Supplier Part Number 2: 52K6607; Supplier 2: Newark; Supplier Part Number 3: 71-CRCW0402-100K-E3; Supplier 3: Mouser; Value_Code: 100k; RoHS: E; Value1: 1%; MountType: SMT; Supplier 1: Digi-Key; PackageReference: 0402; Tolerance_%: 1%; Res_ohm: 100k; SizeArea_mm2: 0.5; CompType: Resistor; PartNumber: CRCW0402100KFKED; ComponentLink1Description: Datasheet link; Supplier Part Number 1: 541-100KLCT-ND; Technology: Thick Film; ComponentLink1URL: http://www.vishay.com/docs/20035/dcrcwe3.pdf
R24 = CMP-0026367-2: RES, 40.2 k, 1%, 0.063 W, AEC-Q200 Grade 0, 0402; Manufacturer: Vishay-Dale; Power_W: 63mW; TempCo: 100 ppm/C; Value_Code: 40k2; Value: 40.2k; EIA_Code: E96; SizeX_mm: 1; SizeY_mm: 0.5; SizeZ_mm: 0.6; Value2: 0.063W; AEC Qualified: Y; VDC_V: 50V; AEC Category: Q200; AEC Grade: 0; ComponentLink1URL: http://www.vishay.com/docs/20035/dcrcwe3.pdf; Supplier Part Number 2: 52K7049; Supplier 2: Newark; Supplier Part Number 3: 71-CRCW0402-40.2K-E3; Supplier 3: Mouser; RoHS: E; Value1: 1%; MountType: SMT; Supplier 1: Digi-Key; PackageReference: 0402; Tolerance_%: 1%; Res_ohm: 40.2k; SizeArea_mm2: 0.5; CompType: Resistor; PartNumber: CRCW040240K2FKED; ComponentLink1Description: Datasheet link; Supplier Part Number 1: 541-40.2KLCT-ND; Technology: Thick Film
R25 = CMP-0026163-2: RES, 20.5 k, 1%, 0.063 W, AEC-Q200 Grade 0, 0402; Manufacturer: Vishay-Dale; Power_W: 63mW; TempCo: 100 ppm/C; Value_Code: 20k5; Value: 20.5k; EIA_Code: E96; SizeX_mm: 1; SizeY_mm: 0.5; SizeZ_mm: 0.6; Value2: 0.063W; AEC Qualified: Y; VDC_V: 50V; AEC Category: Q200; AEC Grade: 0; ComponentLink1URL: http://www.vishay.com/docs/20035/dcrcwe3.pdf; Supplier Part Number 2: 52K6819; Supplier 2: Newark; Supplier Part Number 3: 71-CRCW0402-20.5K-E3; Supplier 3: Mouser; RoHS: E; Value1: 1%; MountType: SMT; Supplier 1: Digi-Key; PackageReference: 0402; Tolerance_%: 1%; Res_ohm: 20.5k; SizeArea_mm2: 0.5; CompType: Resistor; PartNumber: CRCW040220K5FKED; ComponentLink1Description: Datasheet link; Supplier Part Number 1: 541-20.5KLCT-ND; Technology: Thick Film
R26 = CMP-0026586-2: RES, 88.7 k, 1%, 0.063 W, AEC-Q200 Grade 0, 0402; Manufacturer: Vishay-Dale; Power_W: 63mW; TempCo: 100 ppm/C; Value_Code: 88k7; Value: 88.7k; EIA_Code: E96; SizeX_mm: 1; SizeY_mm: 0.5; SizeZ_mm: 0.6; Value2: 0.063W; AEC Qualified: Y; VDC_V: 50V; AEC Category: Q200; AEC Grade: 0; ComponentLink1URL: http://www.vishay.com/docs/20035/dcrcwe3.pdf; Supplier Part Number 2: 52K7326; Supplier 2: Newark; Supplier Part Number 3: 71-CRCW0402-88.7K-E3; Supplier 3: Mouser; RoHS: E; Value1: 1%; MountType: SMT; Supplier 1: Digi-Key; PackageReference: 0402; Tolerance_%: 1%; Res_ohm: 88.7k; SizeArea_mm2: 0.5; CompType: Resistor; PartNumber: CRCW040288K7FKED; ComponentLink1Description: Datasheet link; Supplier Part Number 1: 541-88.7KLCT-ND; Technology: Thick Film
R27 = CMP-0025958-3: as R18 on sheet LM76003; Supplier Part Number 2: 52K6595; Supplier 2: Newark; Supplier Part Number 3: 71-CRCW0402-10K-E3; Supplier 3: Mouser; RoHS: E; Value1: 1%; MountType: SMT; Supplier 1: Digi-Key; PackageReference: 0402; Tolerance_%: 1%; SizeArea_mm2: 0.5; CompType: Resistor; PartNumber: CRCW040210K0FKED; ComponentLink1Description: Datasheet link; Supplier Part Number 1: 541-10.0KLCT-ND; Technology: Thick Film; ComponentLink1URL: http://www.vishay.com/docs/20035/dcrcwe3.pdf
U5 = CMP-0081433-1: 4V to 36V, 2A Step-Down DC/DC Power Module in Compact 7x9x4mm QFN Package, RLR0018A (B3QFN-18); Alternate PartNumber: LMZM33603RLRT; Alternate Manufacturer: Texas Instruments; SizeAreaWB_mm2: 99; Rating: Catalog; SizeZ_mm: 4.1; SizeX_mm: 7; SizeY_mm: 9; SizeArea_mm2: 63; CompType: IC; AEC Qualified: N; AEC Category: Q200; ComponentLink1URL: http://www.ti.com/lit/ds/symlink/lmzm33603.pdf; PackageDescription: B3QFN-18; RoHS: Y; MountType: SMT; ComponentLink2URL: http://www.ti.com/product/lmzm33603; ComponentLink3Description: Online Datasheet; ComponentLink2Description: Product Folder; Manufacturer: Texas Instruments; ComponentLink3URL: http://www.ti.com/product/lmzm33603/datasheet; PackageReference: RLR0018A; Operating Temprature Range: -40 to 105 C; PartNumber: LMZM33603RLRR; ComponentLink1Description: Datasheet Link

## Sheet LMZ10500.SchDoc
size 431 x 279 mm; Date: Not shown in title block; ApprovedBy: Not shown in title block; CheckedBy: Not shown in title block; Author: Not shown in title block; CompanyName: Not shown in title block; DrawnBy: Andy Lin (TI); Engineer: Not shown in title block; Organization: Not shown in title block; Address1: Not shown in title block; Address2: Not shown in title block; Address3: Not shown in title block; Address4: Not shown in title block; DocumentNumber: 8; Revision: Use project parameter SCH_Rev; SheetNumber: 8; SheetTotal: 14; PageSetup: Record=PageOptions|CenterHorizontal=True|CenterVertical=True|PrintScale=1.00|XCorrection=1.00|YCorrection=1.00|PrintKind=0|BorderSize=5000000|LeftOffset=0|BottomOffset=0|Orientation=2|PaperLength=1000|PaperWidth=1000|Scale=100|PaperSource=15|PrintQuality=600|MediaType=1|DitherType=10|PaperKind=Letter|PrintScaleMode=1; CurrentTime: Not shown in title block; CurrentDate: Not shown in title block; Time: Not shown in title block; DocumentFullPathAndName: Not shown in title block; DocumentName: Not shown in title block; ModifiedDate: Not shown in title block; ImagePath: Not shown in title block
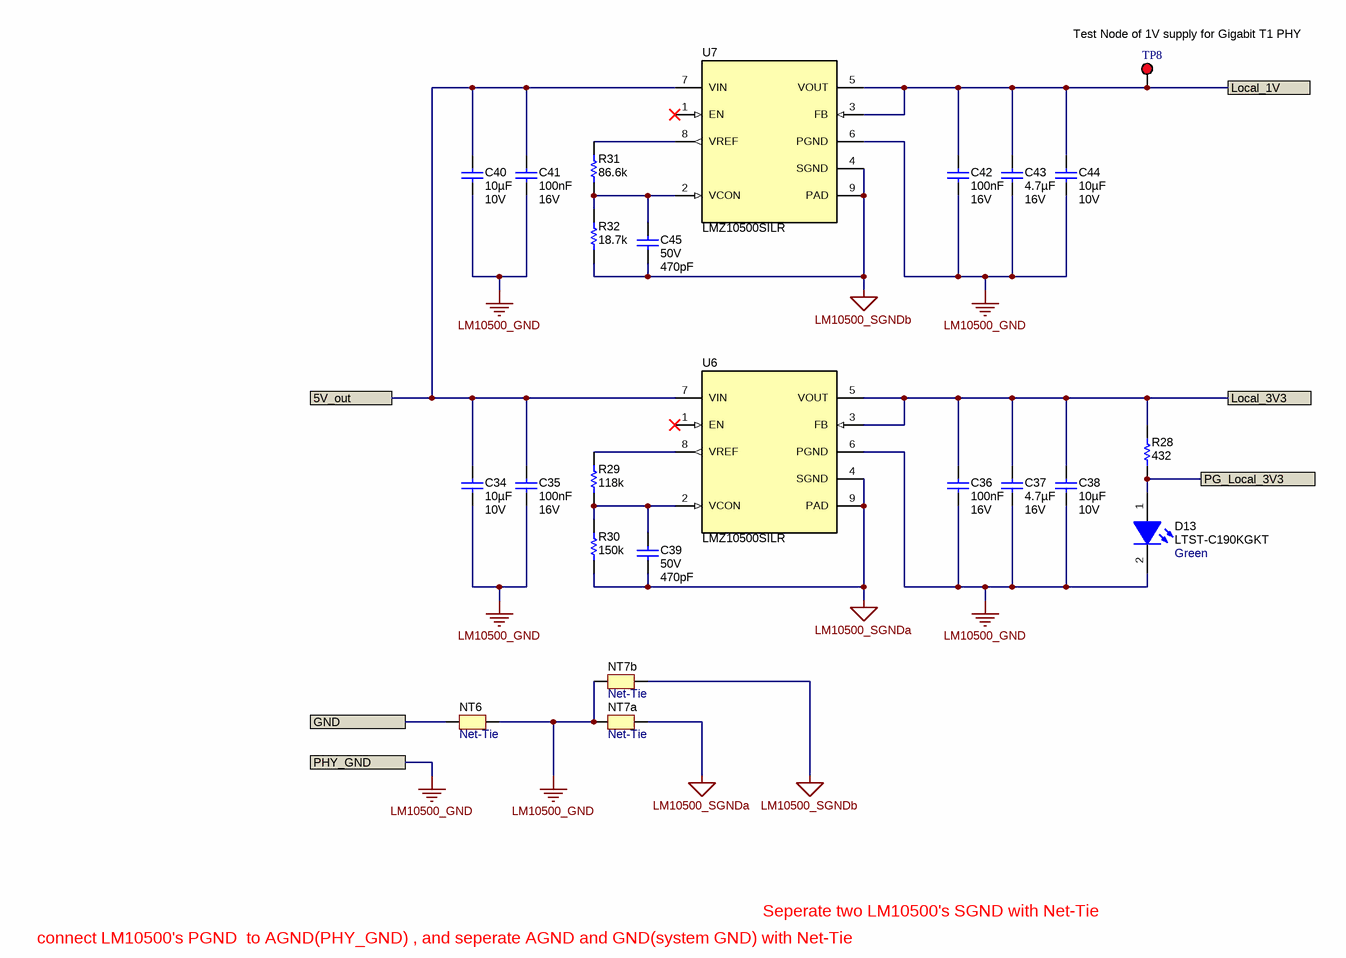
[diagram p5: LMZ10500.SchDoc]

### Parts
C34  Cap_F: 10µF  VDC_V: 10V  [0603]  (hidden comment: GRM188Z71A106MA73D)
C35  Cap_F: 100nF  VDC_V: 16V  [0603]  (hidden comment: GRM188R71C104KA01D)
C36  Cap_F: 100nF  VDC_V: 16V  [0603]  (hidden comment: GRM188R71C104KA01D)
C37  Cap_F: 4.7µF  VDC_V: 16V  [0603]  (hidden comment: GRM188Z71C475KE21D)
C38  Cap_F: 10µF  VDC_V: 10V  [0603]  (hidden comment: GRM188Z71A106MA73D)
C39  VDC_V: 50V  ValueDisplayed: 470pF  [0402]  (hidden comment: GCM155R71H471KA37D)
C40  Cap_F: 10µF  VDC_V: 10V  [0603]  (hidden comment: GRM188Z71A106MA73D)
C41  Cap_F: 100nF  VDC_V: 16V  [0603]  (hidden comment: GRM188R71C104KA01D)
C42  Cap_F: 100nF  VDC_V: 16V  [0603]  (hidden comment: GRM188R71C104KA01D)
C43  Cap_F: 4.7µF  VDC_V: 16V  [0603]  (hidden comment: GRM188Z71C475KE21D)
C44  Cap_F: 10µF  VDC_V: 10V  [0603]  (hidden comment: GRM188Z71A106MA73D)
C45  VDC_V: 50V  ValueDisplayed: 470pF  [0402]  (hidden comment: GCM155R71H471KA37D)
D13  LTST-C190KGKT  value Green  [LED_LTST-C190_G]
NT6  Net-Tie  [Net-Tie_50milWide_30milLong]  (net tie, no BOM)
NT7a  Net-Tie  [NetTie_0402]  (net tie, no BOM)
NT7b  Net-Tie  [NetTie_0402]  (net tie, no BOM)
R28  ValueDisplayed: 432  [0603]  (hidden comment: CRCW0603432RFKEA)
R29  ValueDisplayed: 118k  [0402]  (hidden comment: CRCW0402118KFKED)
R30  ValueDisplayed: 150k  [0402]  (hidden comment: CRCW0402150KFKED)
R31  ValueDisplayed: 86.6k  [0402]  (hidden comment: CRCW040286K6FKED)
R32  ValueDisplayed: 18.7k  [0402]  (hidden comment: CRCW040218K7FKED)
TP8  5000  [Keystone5000]  (value not drawn)
U6  LMZ10500SILR  [SIL0008A]
U7  LMZ10500SILR  [SIL0008A]

### Ports
5V_out, GND, Local_1V, Local_3V3, PG_Local_3V3, PHY_GND

### Nets
ILIM_GND: NT6.1 ; port GND
LM10500_GND: C34.2 C35.2 C36.2 C37.2 C38.2 C40.2 C41.2 C42.2 C43.2 C44.2 D13.2(K) NT6.2 NT7a.1 NT7b.1 U6.6(PGND) U7.6(PGND) ; port PHY_GND
LM10500_SGNDa: C39.2 NT7a.2 R30.1 U6.4(SGND) U6.9(PAD)
LM10500_SGNDb: C45.2 NT7b.2 R32.1 U7.4(SGND) U7.9(PAD)
5V_out: C34.1 C35.1 C40.1 C41.1 U6.7(VIN) U7.7(VIN) ; port 5V_out
Local_1V: C42.1 C43.1 C44.1 TP8.1 U7.3(FB) U7.5(VOUT) ; port Local_1V
Local_3V3: C36.1 C37.1 C38.1 R28.2 U6.3(FB) U6.5(VOUT) ; port Local_3V3
PG_Local_3V3: D13.1(A) R28.1 ; port PG_Local_3V3
NetC39_1: C39.1 R29.1 R30.2 U6.2(VCON)
NetC45_1: C45.1 R31.1 R32.2 U7.2(VCON)
NetR29_2: R29.2 U6.8(VREF)
NetR31_2: R31.2 U7.8(VREF)

Not connected (* = marked no-connect by the designer): U6 1(EN)*; U7 1(EN)*

### Notes on the sheet
- (near TP8) Test Node of 1V supply for Gigabit T1 PHY
- connect LM10500's PGND  to AGND(PHY_GND) , and seperate AGND and GND(system GND) with Net-Tie
- Seperate two LM10500's SGND with Net-Tie
- Drawn By:
- SVN Rev:
- Number:
- TID #:
- Orderable:
- Rev:
- Sheet Title:
- File:
- Project Title:
- Designed for:
- Assembly Variant:
- Mod. Date:
- Sheet:
- Size:
- of
- B
- http://www.ti.com
- Texas Instruments and/or its licensors do not warrant the accuracy or completeness of this specification or any information contained therein. Texas Instruments and/or its licensors do not warrant that this design will meet the specifications, will be suitable for your application or fit for any particular purpose, or will operate in an implementation. Texas Instruments and/or its licensors do not warrant that the design is production worthy. You should completely validate and test your design implementation to confirm the system functionality for your application.
- Engineer:
- Contact:
- © Texas Instruments

### Library data of the parts
C34 C38 C40 C44 = CMP-0007497-5: CAP, CERM, 10 uF, 10 V, +/- 20%, X7R, 0603; Manufacturer: MuRata; TaMin_C: -55°C; Polarized: N; SizeAreaWB_mm2: 4.68; Value1: Unknown; U/M: EA; Value: 10uF; TaMax_C: 125°C; SizeZ_mm: 1; SizeX_mm: 1.6; SizeY_mm: 0.8; SizeArea_mm2: 1.28; AEC Category: Q200; Publisher: Texas Instruments; TempCo: X7R; Published: 2008-06-19; RoHS: Y; MountType: SMT; Supplier 1: Mouser; PackageReference: 0603; Tolerance_%: 20%; Cap_Case: 0603; Value2: 10V; CompType: Capacitor; LatestRevisionDate: 2017-03-09; PartNumber: GRM188Z71A106MA73D; AEC Qualified: N; ComponentLink1Description: Datasheet link; AEC Grade: N/A; Supplier Part Number 1: 81-GRM188Z71A106MA3D; Technology: Ceramic; ValueDisplayed: 10uF; ComponentLink1URL: http://psearch.en.murata.com/capacitor/product/GRM188Z71A106MA73%23.pdf
C35 C36 C41 C42 = CMP-0007378-4: as C4 on sheet T1_Power_Top_Level; Supplier Part Number 2: 81-GRM39X104K16; Publisher: Texas Instruments; Supplier 2: Mouser; Supplier Part Number 3: 1828890; TempCo: X7R; Supplier 3: Farnell; Published: 2008-06-19; RoHS: Y; MountType: SMT; Supplier 1: Digi-Key; PackageReference: 0603; Tolerance_%: 10%; Cap_Case: 0603; Value2: 16V; CompType: Capacitor; LatestRevisionDate: 2017-03-09; PartNumber: GRM188R71C104KA01D; AEC Qualified: ?; ComponentLink1Description: Datasheet link; Supplier Part Number 1: 490-1532-1-ND; Technology: Ceramic; ValueDisplayed: 0.1uF; ComponentLink1URL: http://search.murata.co.jp/Ceramy/PnsearchViewAction.do?HnOFG=ON&HnNFG=ON&SEL_CNT=50&sLang=en&sKey=GRM188R71C104KA01D&x=9&y=9&search=startwith
C37 C43 = CMP-0064936-4: CAP, CERM, 4.7 uF, 16 V,+/- 10%, X7R, 0603; Manufacturer: MuRata; TaMin_C: -55°C; Polarized: N; SizeAreaWB_mm2: 4.68; Value1: Unknown; U/M: EA; Value: 4.7uF; TaMax_C: 125°C; SizeZ_mm: 1; SizeX_mm: 1.6; SizeY_mm: 0.8; SizeArea_mm2: 1.28; AEC Category: Q200; Publisher: Texas Instruments; TempCo: X7R; Published: 2008-06-19; RoHS: Y; MountType: SMT; PackageReference: 0603; Tolerance_%: 10%; Cap_Case: 0603; Value2: 16V; CompType: Capacitor; LatestRevisionDate: 2017-06-05; PartNumber: GRM188Z71C475KE21D; AEC Qualified: N; ComponentLink1Description: Datasheet link; AEC Grade: N/A; Technology: Ceramic; ValueDisplayed: 4.7uF; ComponentLink1URL: http://search.murata.co.jp/Ceramy/image/img/A01X/G101/ENG/GRM188Z71C475KE21-01.pdf
C39 C45 = CMP-0006360-2: CAP, CERM, 470 pF, 50 V, +/- 10%, X7R, AEC-Q200 Grade 1, 0402; Manufacturer: MuRata; TaMin_C: -55°C; Polarized: N; SizeAreaWB_mm2: 3; Value1: Unknown; U/M: EA; Value: 470pF; TaMax_C: 125°C; SizeZ_mm: 0.6; SizeX_mm: 1; SizeY_mm: 0.5; AEC Qualified: Y; AEC Category: Q200; Supplier Part Number 2: 81-GCM155R71H471K37D; Publisher: Texas Instruments; Supplier 2: Mouser; TempCo: X7R; Published: 2008-06-19; RoHS: Y; MountType: SMT; Supplier 1: Digi-Key; PackageReference: 0402; Tolerance_%: 10%; Cap_Case: 0402; Value2: 50V; SizeArea_mm2: 0.5; CompType: Capacitor; LatestRevisionDate: 2017-03-09; PartNumber: GCM155R71H471KA37D; Cap_F: 470pF; ComponentLink1Description: Datasheet link; AEC Grade: 1; Supplier Part Number 1: 490-4913-1-ND; Technology: Ceramic; ComponentLink1URL: http://psearch.murata.com/capacitor/product/GCM155R71H471KA37%23.pdf
D13 = CMP-0002840-2: LED, Green, SMD; Manufacturer: Lite-On; Value1: W; Io_A: 30mA; Value2: 2V; Tjmax_C: 85°C; Type: AlInGaP; PartNumber: LTST-C190KGKT; MountType: SMT; CompType: LED; Color: green; ComponentLink1Description: Datasheet link; RoHS: Y; ComponentLink1URL: http://optoelectronics.liteon.com/en-us/api/DwonloadFileHandler.ashx?txtSpecNo=DS22-2000-074&txtPartNo=LTST-C190KGKT; Vf_V: 2V; PackageReference: 1.6x0.8x0.8mm
NT6 NT7a NT7b = CMP-0078142-2: Single point connection between nets.; CompType: Net-Tie; PackageReference: N/A; Library Reference: Net-Tie; Manufacturer: N/A; PartNumber: N/A; MountType: SMT
R28 = CMP-0022421-5: RES, 432, 1%, 0.1 W, AEC-Q200 Grade 0, 0603; Manufacturer: Vishay-Dale; Power_W: 100mW; TempCo: 100 ppm/C; Value_Code: 432R; Value: 432; EIA_Code: E96; SizeX_mm: 1.6; SizeY_mm: 0.8; SizeZ_mm: 1; Value2: 0.1W; SizeArea_mm2: 1.28; AEC Qualified: Y; VDC_V: 75V; AEC Category: Q200; AEC Grade: 0; Supplier Part Number 2: 52K8531; Supplier 2: Newark; Supplier Part Number 3: 71-CRCW0603-432-E3; Supplier 3: Mouser; RoHS: E; Value1: 1%; MountType: SMT; Supplier 1: Digi-Key; PackageReference: 0603; Tolerance_%: 1%; Res_ohm: 432; CompType: Resistor; PartNumber: CRCW0603432RFKEA; ComponentLink1Description: Datasheet link; Supplier Part Number 1: 541-432HCT-ND; Technology: Thick Film; ComponentLink1URL: http://www.vishay.com/docs/20035/dcrcwe3.pdf
R29 = CMP-0025973-3: RES, 118 k, 1%, 0.063 W, AEC-Q200 Grade 0, 0402; Manufacturer: Vishay-Dale; Power_W: 63mW; TempCo: 100 ppm/C; Value: 118k; EIA_Code: E96; SizeX_mm: 1; SizeY_mm: 0.5; SizeZ_mm: 0.6; Value2: 0.063W; AEC Qualified: Y; VDC_V: 50V; AEC Category: Q200; AEC Grade: 0; Supplier Part Number 2: 52K6643; Supplier 2: Newark; Supplier Part Number 3: 71-CRCW0402-118K-E3; Supplier 3: Mouser; Value_Code: 118k; RoHS: E; Value1: 1%; MountType: SMT; Supplier 1: Digi-Key; PackageReference: 0402; Tolerance_%: 1%; Res_ohm: 118k; SizeArea_mm2: 0.5; CompType: Resistor; PartNumber: CRCW0402118KFKED; ComponentLink1Description: Datasheet link; Supplier Part Number 1: 541-118KLCT-ND; Technology: Thick Film; ComponentLink1URL: http://www.vishay.com/docs/20035/dcrcwe3.pdf
R30 = CMP-0026021-3: RES, 150 k, 1%, 0.063 W, AEC-Q200 Grade 0, 0402; Manufacturer: Vishay-Dale; Power_W: 63mW; TempCo: 100 ppm/C; Value: 150k; EIA_Code: E96; SizeX_mm: 1; SizeY_mm: 0.5; SizeZ_mm: 0.6; Value2: 0.063W; AEC Qualified: Y; VDC_V: 50V; AEC Category: Q200; AEC Grade: 0; Supplier Part Number 2: 52K6719; Supplier 2: Newark; Supplier Part Number 3: 71-CRCW0402-150K-E3; Supplier 3: Mouser; Value_Code: 150k; RoHS: E; Value1: 1%; MountType: SMT; Supplier 1: Digi-Key; PackageReference: 0402; Tolerance_%: 1%; Res_ohm: 150k; SizeArea_mm2: 0.5; CompType: Resistor; PartNumber: CRCW0402150KFKED; ComponentLink1Description: Datasheet link; Supplier Part Number 1: 541-150KLCT-ND; Technology: Thick Film; ComponentLink1URL: http://www.vishay.com/docs/20035/dcrcwe3.pdf
R31 = CMP-0026582-2: RES, 86.6 k, 1%, 0.063 W, AEC-Q200 Grade 0, 0402; Manufacturer: Vishay-Dale; Power_W: 63mW; TempCo: 100 ppm/C; Value_Code: 86k6; Value: 86.6k; EIA_Code: E96; SizeX_mm: 1; SizeY_mm: 0.5; SizeZ_mm: 0.6; Value2: 0.063W; AEC Qualified: Y; VDC_V: 50V; AEC Category: Q200; AEC Grade: 0; ComponentLink1URL: http://www.vishay.com/docs/20035/dcrcwe3.pdf; Supplier Part Number 2: 52K7318; Supplier 2: Newark; Supplier Part Number 3: 71-CRCW0402-86.6K-E3; Supplier 3: Mouser; RoHS: E; Value1: 1%; MountType: SMT; Supplier 1: Digi-Key; PackageReference: 0402; Tolerance_%: 1%; Res_ohm: 86.6k; SizeArea_mm2: 0.5; CompType: Resistor; PartNumber: CRCW040286K6FKED; ComponentLink1Description: Datasheet link; Supplier Part Number 1: 541-86.6KLCT-ND; Technology: Thick Film
R32 = CMP-0026060-3: RES, 18.7 k, 1%, 0.063 W, AEC-Q200 Grade 0, 0402; Manufacturer: Vishay-Dale; Power_W: 63mW; TempCo: 100 ppm/C; Value_Code: 18k7; Value: 18.7k; EIA_Code: E96; SizeX_mm: 1; SizeY_mm: 0.5; SizeZ_mm: 0.6; Value2: 0.063W; AEC Qualified: Y; VDC_V: 50V; AEC Category: Q200; AEC Grade: 0; Supplier Part Number 2: 52K6759; Supplier 2: Newark; Supplier Part Number 3: 71-CRCW0402-18.7K-E3; Supplier 3: Mouser; RoHS: E; Value1: 1%; MountType: SMT; Supplier 1: Digi-Key; PackageReference: 0402; Tolerance_%: 1%; Res_ohm: 18.7k; SizeArea_mm2: 0.5; CompType: Resistor; PartNumber: CRCW040218K7FKED; ComponentLink1Description: Datasheet link; Supplier Part Number 1: 541-18.7KLCT-ND; Technology: Thick Film; ComponentLink1URL: http://www.vishay.com/docs/20035/dcrcwe3.pdf
TP8 = CMP-0055137-1: as TP3 on sheet T1_Power_Top_Level; ComponentLink1URL: http://www.keyelco.com/userAssets/file/M60-2p60.pdf; Supplier Part Number 2: 534-5000; Publisher: Texas Instruments; Supplier 2: Mouser; Color: Red; RoHS: Y; MountType: TH; Green_EU RoHS-2: Incomplete; Supplier 1: Digi-Key; Green_EU RoHS: Passed; PackageReference: Red Miniature Testpoint; CompType: Test Point; LatestRevisionDate: 26/05/2017; PartNumber: 5000; ComponentLink1Description: Datasheet URL; Supplier Part Number 1: 36-5000-ND
U6 U7 = CMP-0076407-2: 2.7V to 5.5V, 650mA High Density Nano Module, SIL0008A (USIP-8); Manufacturer: Texas Instruments; Alternate PartNumber: LMZ10500SILT; SizeAreaWB_mm2: 14.4; SizeArea_mm2: 7.8; SizeZ_mm: 1.5; SizeY_mm: 3.0; CompType: IC; SizeX_mm: 2.6; AEC Category: Q200; AEC Qualified: N; ComponentLink1Description: Datasheet Link; RoHS: Y; PackageReference: SIL0008A; PartNumber: LMZ10500SILR; PackageDescription: uSIP-8; Alternate Manufacturer: Texas Instruments; ComponentLink1URL: http://www.ti.com/lit/ds/symlink/lmz10500.pdf; MountType: SMT; ComponentLink2Description: Product Folder; ComponentLink2URL: http://www.ti.com/product/lmz10500; ComponentLink3Description: Online Datasheet; ComponentLink3URL: http://www.ti.com/product/lmz10500/datasheet